# EAGLE schematic console-ifc (EAGLE 7.6.0)

## Sheet 1 of 3
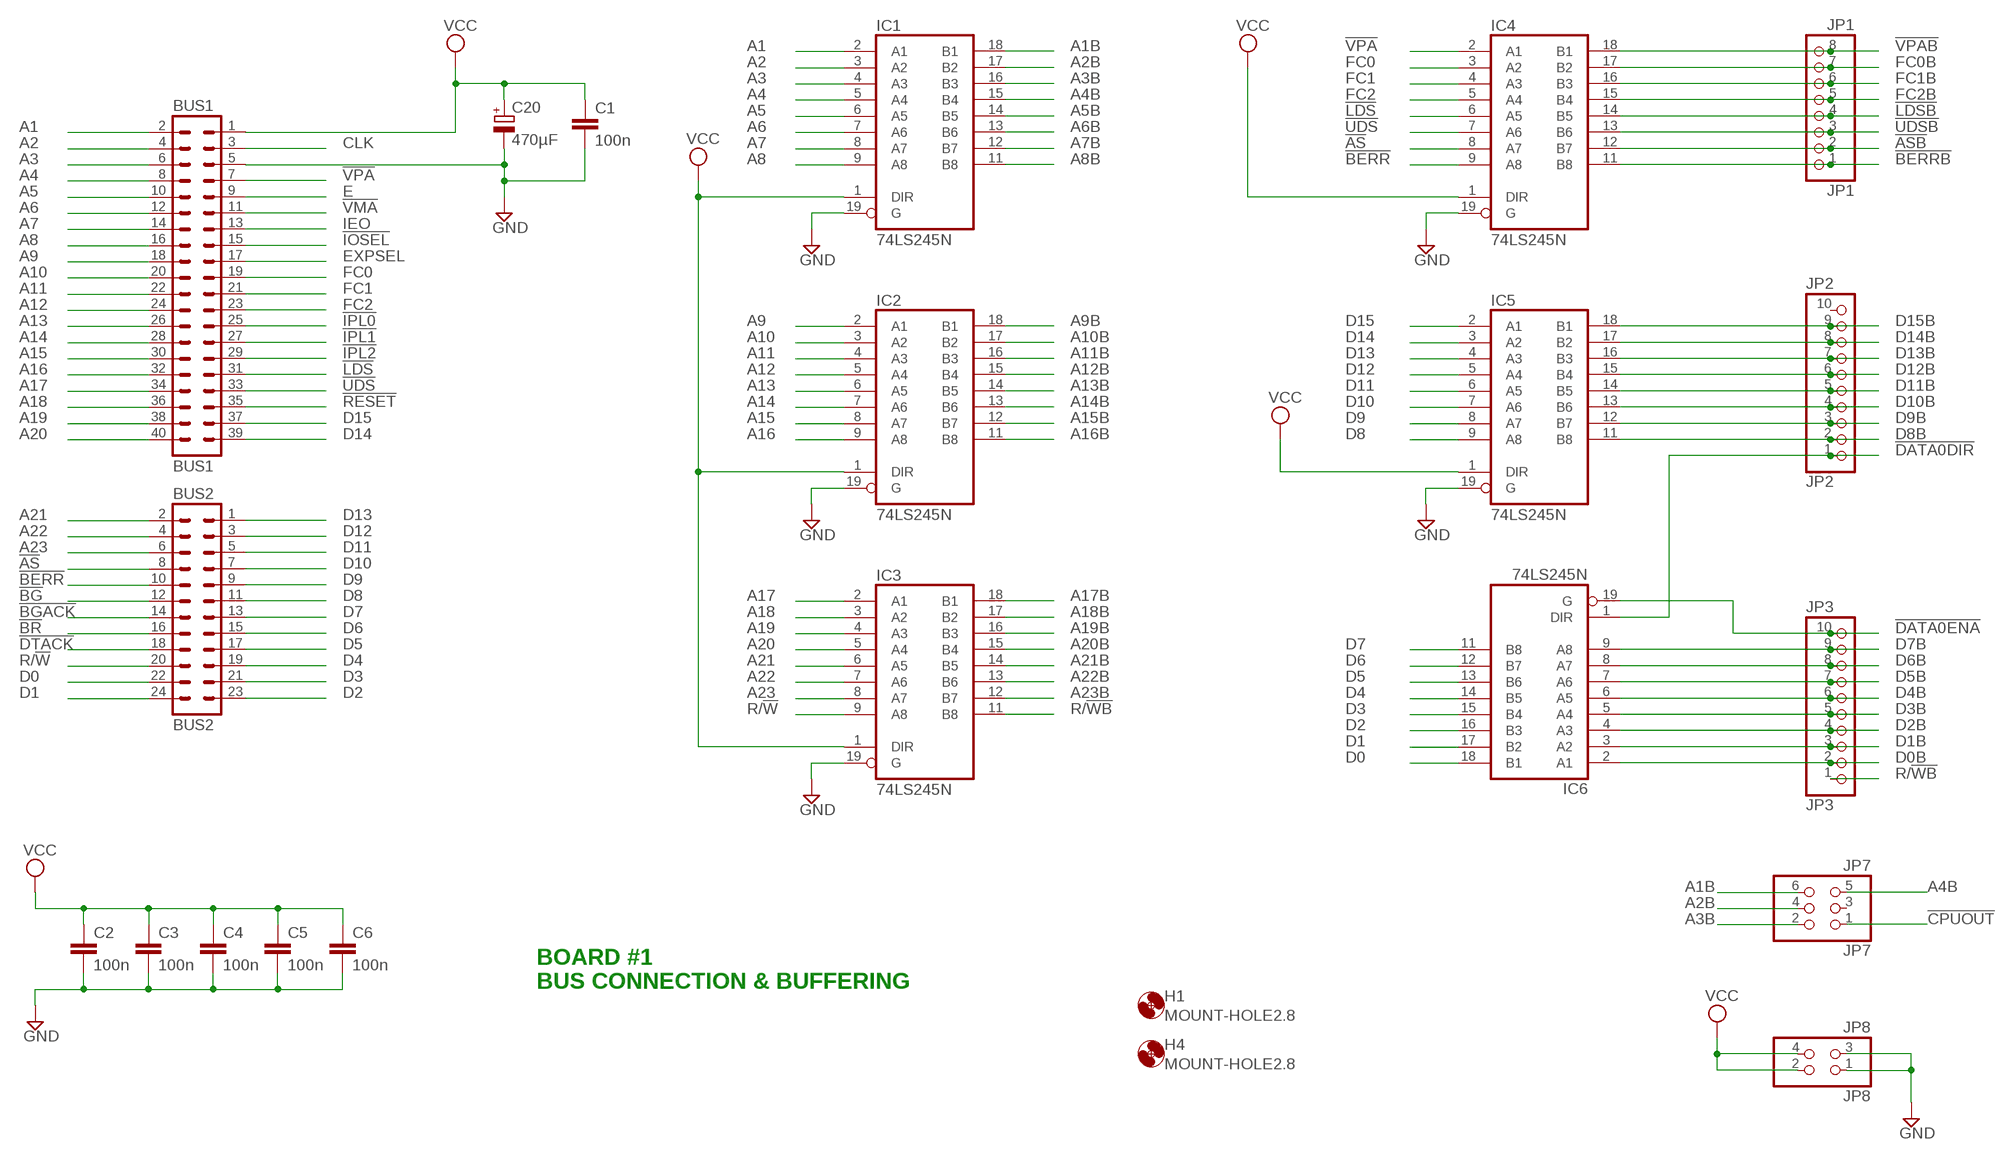
[diagram p0: schematic, sheet 1]

### Parts
BUS1  BUS1  MA20-2  [MA20-2]
BUS2  BUS2  MA12-2  [MA12-2]
C1  100n  C-EU025-024X044  [C025-024X044]
C2  100n  C-EU025-024X044  [C025-024X044]
C3  100n  C-EU025-024X044  [C025-024X044]
C4  100n  C-EU025-024X044  [C025-024X044]
C5  100n  C-EU025-024X044  [C025-024X044]
C6  100n  C-EU025-024X044  [C025-024X044]
C20  470µF  CPOL-EUE2.5-7  [E2,5-7]
H1  MOUNT-HOLE2.8  [2,8]
H4  MOUNT-HOLE2.8  [2,8]
IC1  74LS245N  [DIL20]
IC2  74LS245N  [DIL20]
IC3  74LS245N  [DIL20]
IC4  74LS245N  [DIL20]
IC5  74LS245N  [DIL20]
IC6  74LS245N  [DIL20]
JP1  JP1  PINHD-1X8  [1X08]
JP2  JP2  PINHD-1X10  [1X10]
JP3  JP3  PINHD-1X10  [1X10]
JP7  JP7  PINHD-2X3  [2X03]
JP8  JP8  PINHD-2X2  [2X02]

### Nets
!AS: BUS2.8 IC4.8(A7)
!ASB: IC4.12(B7) JP1.2 ; also sheet 2
!BERR: BUS2.10 IC4.9(A8)
!BERRB: IC4.11(B8) JP1.1
!BG: BUS2.12
!BGACK: BUS2.14
!BR: BUS2.16
!CPUOUT: JP7.1 ; also sheet 2
!DATA0DIR: IC6.1(DIR) JP2.1
!DATA0ENA: IC6.19(G) JP3.10
!DTACK: BUS2.18 ; also sheet 2
!IOSEL: BUS1.15 ; also sheet 2
!IPL0: BUS1.25 ; also sheet 2
!IPL1: BUS1.27 ; also sheet 2
!IPL2: BUS1.29 ; also sheet 2
!LDS: BUS1.31 IC4.6(A5)
!LDSB: IC4.14(B5) JP1.4 ; also sheet 2
!RESET: BUS1.35 ; also sheet 2,3
!UDS: BUS1.33 IC4.7(A6)
!UDSB: IC4.13(B6) JP1.3
!VMA: BUS1.11
!VPA: BUS1.7 IC4.2(A1) ; also sheet 2
!VPAB: IC4.18(B1) JP1.8
A1: BUS1.2 IC1.2(A1)
A1B: IC1.18(B1) JP7.6 ; also sheet 2
A2: BUS1.4 IC1.3(A2)
A2B: IC1.17(B2) JP7.4 ; also sheet 2
A3: BUS1.6 IC1.4(A3)
A3B: IC1.16(B3) JP7.2 ; also sheet 2
A4: BUS1.8 IC1.5(A4)
A4B: IC1.15(B4) JP7.5 ; also sheet 2
A5: BUS1.10 IC1.6(A5)
A5B: IC1.14(B5) ; also sheet 2
A6: BUS1.12 IC1.7(A6)
A6B: IC1.13(B6) ; also sheet 2
A7: BUS1.14 IC1.8(A7)
A7B: IC1.12(B7) ; also sheet 2
A8: BUS1.16 IC1.9(A8)
A8B: IC1.11(B8) ; also sheet 2
A9: BUS1.18 IC2.2(A1)
A9B: IC2.18(B1) ; also sheet 2
A10: BUS1.20 IC2.3(A2)
A10B: IC2.17(B2) ; also sheet 2
A11: BUS1.22 IC2.4(A3)
A11B: IC2.16(B3) ; also sheet 2
A12: BUS1.24 IC2.5(A4)
A12B: IC2.15(B4) ; also sheet 2
A13: BUS1.26 IC2.6(A5)
A13B: IC2.14(B5) ; also sheet 2
A14: BUS1.28 IC2.7(A6)
A14B: IC2.13(B6) ; also sheet 2
A15: BUS1.30 IC2.8(A7)
A15B: IC2.12(B7) ; also sheet 2
A16: BUS1.32 IC2.9(A8)
A16B: IC2.11(B8) ; also sheet 2
A17: BUS1.34 IC3.2(A1)
A17B: IC3.18(B1) ; also sheet 2
A18: BUS1.36 IC3.3(A2)
A18B: IC3.17(B2) ; also sheet 2
A19: BUS1.38 IC3.4(A3)
A19B: IC3.16(B3) ; also sheet 2
A20: BUS1.40 IC3.5(A4)
A20B: IC3.15(B4) ; also sheet 2
A21: BUS2.2 IC3.6(A5)
A21B: IC3.14(B5) ; also sheet 2
A22: BUS2.4 IC3.7(A6)
A22B: IC3.13(B6) ; also sheet 2
A23: BUS2.6 IC3.8(A7)
A23B: IC3.12(B7) ; also sheet 2
CLK: BUS1.3
D0: BUS2.22 IC6.18(B1)
D0B: IC6.2(A1) JP3.2 ; also sheet 3
D1: BUS2.24 IC6.17(B2)
D1B: IC6.3(A2) JP3.3 ; also sheet 3
D2: BUS2.23 IC6.16(B3)
D2B: IC6.4(A3) JP3.4 ; also sheet 3
D3: BUS2.21 IC6.15(B4)
D3B: IC6.5(A4) JP3.5 ; also sheet 3
D4: BUS2.19 IC6.14(B5)
D4B: IC6.6(A5) JP3.6 ; also sheet 3
D5: BUS2.17 IC6.13(B6)
D5B: IC6.7(A6) JP3.7 ; also sheet 3
D6: BUS2.15 IC6.12(B7)
D6B: IC6.8(A7) JP3.8 ; also sheet 3
D7: BUS2.13 IC6.11(B8)
D7B: IC6.9(A8) JP3.9 ; also sheet 3
D8: BUS2.11 IC5.9(A8)
D8B: IC5.11(B8) JP2.2
D9: BUS2.9 IC5.8(A7)
D9B: IC5.12(B7) JP2.3
D10: BUS2.7 IC5.7(A6)
D10B: IC5.13(B6) JP2.4
D11: BUS2.5 IC5.6(A5)
D11B: IC5.14(B5) JP2.5
D12: BUS2.3 IC5.5(A4)
D12B: IC5.15(B4) JP2.6
D13: BUS2.1 IC5.4(A3)
D13B: IC5.16(B3) JP2.7
D14: BUS1.39 IC5.3(A2)
D14B: IC5.17(B2) JP2.8
D15: BUS1.37 IC5.2(A1)
D15B: IC5.18(B1) JP2.9
E: BUS1.9
EXPSEL: BUS1.17
FC0: BUS1.19 IC4.3(A2)
FC0B: IC4.17(B2) JP1.7 ; also sheet 2
FC1: BUS1.21 IC4.4(A3)
FC1B: IC4.16(B3) JP1.6 ; also sheet 2
FC2: BUS1.23 IC4.5(A4)
FC2B: IC4.15(B4) JP1.5 ; also sheet 2
GND [Power]: BUS1.5 C1.2 C2.2 C3.2 C4.2 C5.2 C6.2 C20.- IC1.19(G) IC2.19(G) IC3.19(G) IC4.19(G) IC5.19(G) JP8.1 JP8.3 ; also sheet 2,3
IEO: BUS1.13
R/!W: BUS2.20 IC3.9(A8)
R/!WB: IC3.11(B8) JP3.1
VCC [Power]: BUS1.1 C1.1 C2.1 C3.1 C4.1 C5.1 C6.1 C20.+ IC1.1(DIR) IC2.1(DIR) IC3.1(DIR) IC4.1(DIR) IC5.1(DIR) JP8.2 JP8.4 ; also sheet 2,3
Unconnected: JP2.10 JP7.3

### Notes on the sheet
- BOARD #1
  BUS CONNECTION & BUFFERING

## Sheet 2 of 3
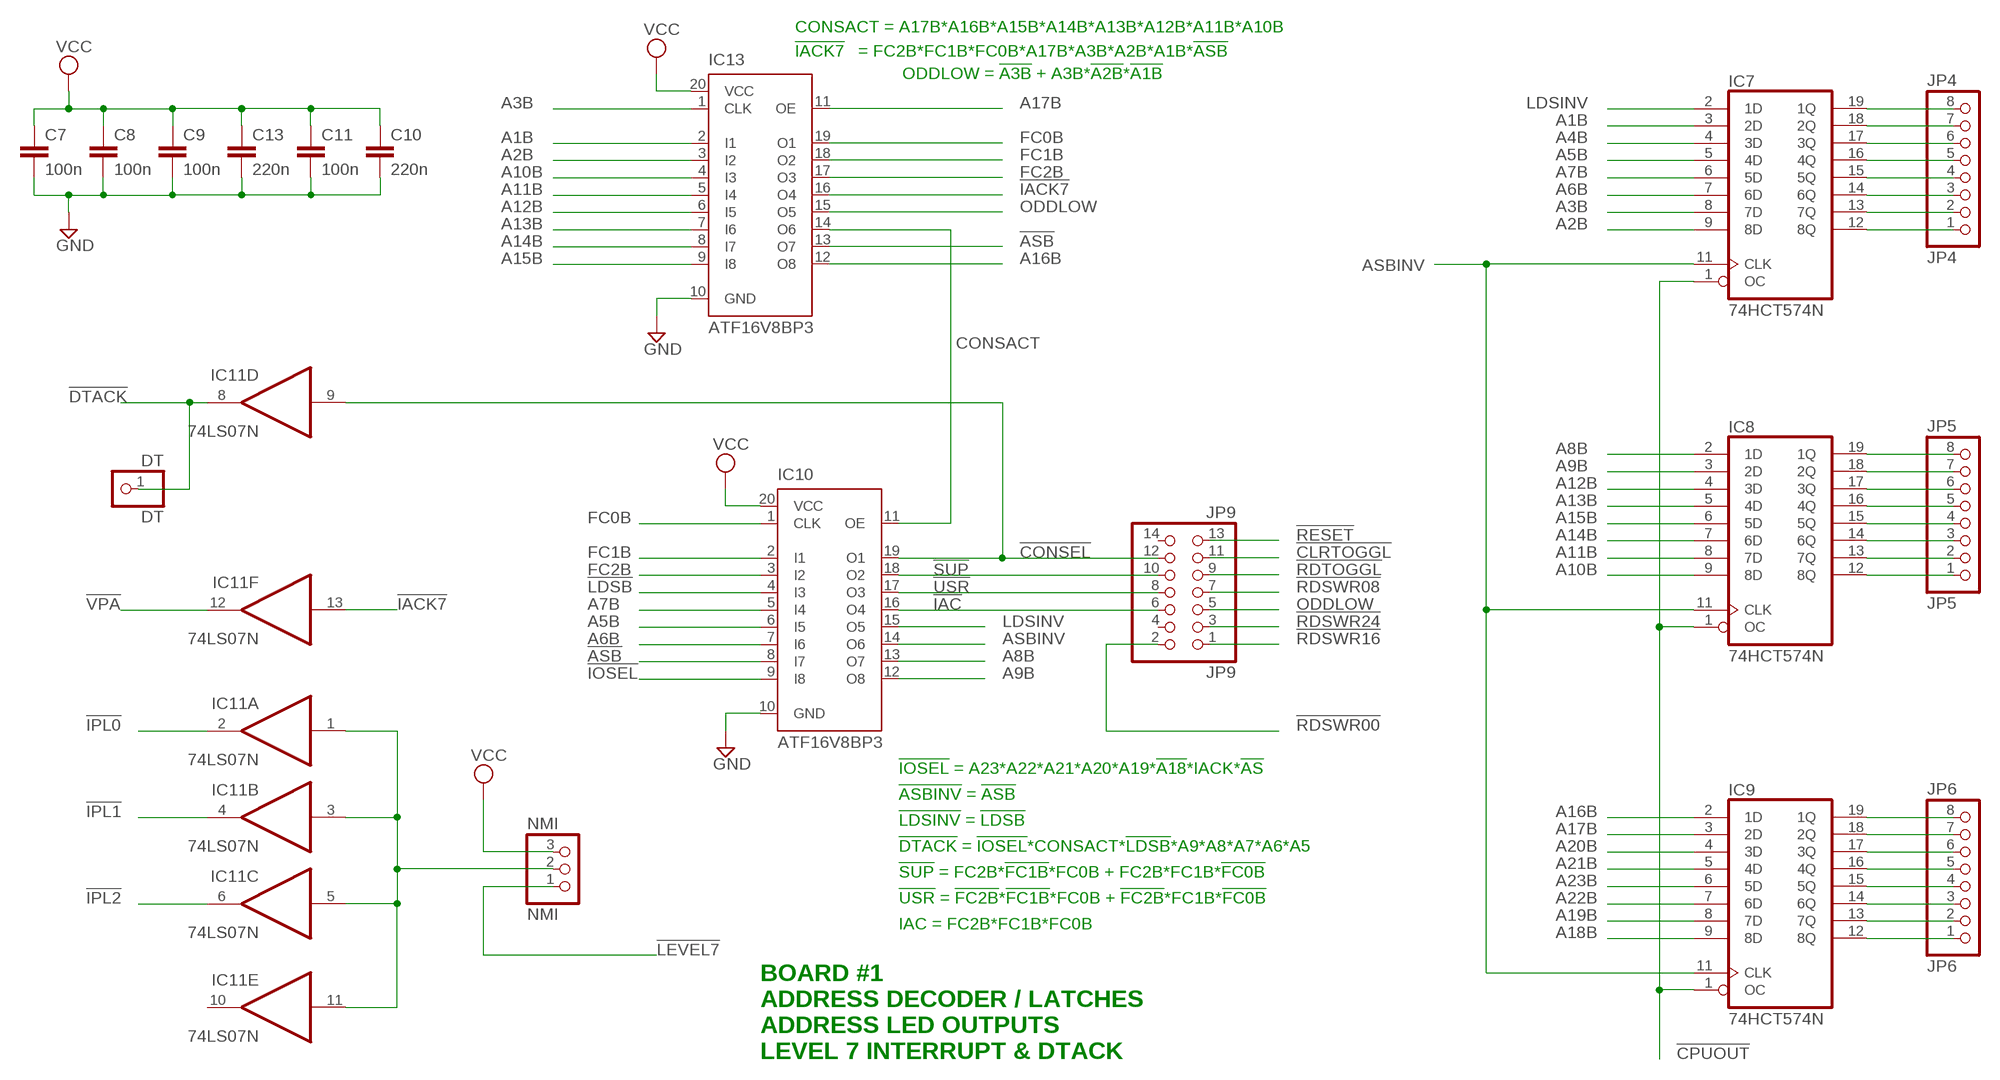
[diagram p1: schematic, sheet 2]

### Parts
C7  100n  C-EU025-024X044  [C025-024X044]
C8  100n  C-EU025-024X044  [C025-024X044]
C9  100n  C-EU025-024X044  [C025-024X044]
C10  220n  C-EU025-024X044  [C025-024X044]
C11  100n  C-EU025-024X044  [C025-024X044]
C13  220n  C-EU025-024X044  [C025-024X044]
DT  DT  PINHD-1X1  [1X01]
IC7  74HCT574N  [DIL20]
IC8  74HCT574N  [DIL20]
IC9  74HCT574N  [DIL20]
IC10  ATF16V8BP3  [DIL20]
IC11  74LS07N  [DIL14]
IC13  ATF16V8BP3  [DIL20]
JP4  JP4  PINHD-1X8  [1X08]
JP5  JP5  PINHD-1X8  [1X08]
JP6  JP6  PINHD-1X8  [1X08]
JP9  JP9  PINHD-2X7  [2X07]
NMI  NMI  PINHD-1X3  [1X03]

### Nets
!ASB: IC10.8(I7) IC13.13(O7) ; also sheet 1
!CLRTOGGL: JP9.11 ; also sheet 3
!CONSEL: IC10.19(O1) IC11.9(D:I) JP9.12
!CPUOUT: IC7.1(OC) IC8.1(OC) IC9.1(OC) ; also sheet 1
!DTACK: DT.1 IC11.8(D:O) ; also sheet 1
!IAC: IC10.16(O4) JP9.6
!IACK7: IC11.13(F:I) IC13.16(O4) ; also sheet 3
!IOSEL: IC10.9(I8) ; also sheet 1
!IPL0: IC11.2(A:O) ; also sheet 1
!IPL1: IC11.4(B:O) ; also sheet 1
!IPL2: IC11.6(C:O) ; also sheet 1
!LDSB: IC10.4(I3) ; also sheet 1
!LEVEL7: NMI.1 ; also sheet 3
!RDSWR00: JP9.2 ; also sheet 3
!RDSWR08: JP9.7 ; also sheet 3
!RDSWR16: JP9.1 ; also sheet 3
!RDSWR24: JP9.3 ; also sheet 3
!RDTOGGL: JP9.9 ; also sheet 3
!RESET: JP9.13 ; also sheet 1,3
!SUP: IC10.18(O2) JP9.10
!USR: IC10.17(O3) JP9.8
!VPA: IC11.12(F:O) ; also sheet 1
A1B: IC7.3(2D) IC13.2(I1) ; also sheet 1
A2B: IC7.9(8D) IC13.3(I2) ; also sheet 1
A3B: IC7.8(7D) IC13.1(CLK) ; also sheet 1
A4B: IC7.4(3D) ; also sheet 1
A5B: IC7.5(4D) IC10.6(I5) ; also sheet 1
A6B: IC7.7(6D) IC10.7(I6) ; also sheet 1
A7B: IC7.6(5D) IC10.5(I4) ; also sheet 1
A8B: IC8.2(1D) IC10.13(O7) ; also sheet 1
A9B: IC8.3(2D) IC10.12(O8) ; also sheet 1
A10B: IC8.9(8D) IC13.4(I3) ; also sheet 1
A11B: IC8.8(7D) IC13.5(I4) ; also sheet 1
A12B: IC8.4(3D) IC13.6(I5) ; also sheet 1
A13B: IC8.5(4D) IC13.7(I6) ; also sheet 1
A14B: IC8.7(6D) IC13.8(I7) ; also sheet 1
A15B: IC8.6(5D) IC13.9(I8) ; also sheet 1
A16B: IC9.2(1D) IC13.12(O8) ; also sheet 1
A17B: IC9.3(2D) IC13.11(OE) ; also sheet 1
A18B: IC9.9(8D) ; also sheet 1
A19B: IC9.8(7D) ; also sheet 1
A20B: IC9.4(3D) ; also sheet 1
A21B: IC9.5(4D) ; also sheet 1
A22B: IC9.7(6D) ; also sheet 1
A23B: IC9.6(5D) ; also sheet 1
ASBINV: IC7.11(CLK) IC8.11(CLK) IC9.11(CLK) IC10.14(O6)
CONSACT: IC10.11(OE) IC13.14(O6)
FC0B: IC10.1(CLK) IC13.19(O1) ; also sheet 1
FC1B: IC10.2(I1) IC13.18(O2) ; also sheet 1
FC2B: IC10.3(I2) IC13.17(O3) ; also sheet 1
GND [Power]: C7.2 C8.2 C9.2 C10.2 C11.2 C13.2 IC10.10(GND) IC13.10(GND) ; also sheet 1,3
LDSINV: IC7.2(1D) IC10.15(O5)
N$1: IC7.19(1Q) JP4.8
N$2: IC11.1(A:I) IC11.3(B:I) IC11.5(C:I) IC11.11(E:I) NMI.2
N$3: IC8.19(1Q) JP5.8
N$4: IC7.18(2Q) JP4.7
N$7: IC7.17(3Q) JP4.6
N$14: IC7.16(4Q) JP4.5
N$15: IC7.15(5Q) JP4.4
N$16: IC7.14(6Q) JP4.3
N$17: IC7.13(7Q) JP4.2
N$21: IC7.12(8Q) JP4.1
N$22: IC8.18(2Q) JP5.7
N$23: IC8.17(3Q) JP5.6
N$24: IC8.16(4Q) JP5.5
N$25: IC8.15(5Q) JP5.4
N$26: IC8.14(6Q) JP5.3
N$27: IC8.13(7Q) JP5.2
N$28: IC8.12(8Q) JP5.1
N$29: IC9.19(1Q) JP6.8
N$30: IC9.18(2Q) JP6.7
N$31: IC9.17(3Q) JP6.6
N$32: IC9.16(4Q) JP6.5
N$33: IC9.15(5Q) JP6.4
N$34: IC9.14(6Q) JP6.3
N$35: IC9.13(7Q) JP6.2
N$36: IC9.12(8Q) JP6.1
ODDLOW: IC13.15(O5) JP9.5
VCC [Power]: C7.1 C8.1 C9.1 C10.1 C11.1 C13.1 IC10.20(VCC) IC13.20(VCC) NMI.3 ; also sheet 1,3
Unconnected: IC11.10(E:O) JP9.4 JP9.14

### Notes on the sheet
- CONSACT = A17B*A16B*A15B*A14B*A13B*A12B*A11B*A10B
- !IACK7!   = FC2B*FC1B*FC0B*A17B*A3B*A2B*A1B*!ASB
- ODDLOW = !A3B! + A3B*!A2B!*!A1B!
- !IOSEL! = A23*A22*A21*A20*A19*!A18!*IACK*!AS
- !ASBINV! = !ASB
- !LDSINV! = !LDSB
- !DTACK! = !IOSEL!*CONSACT*!LDSB!*A9*A8*A7*A6*A5
- !SUP! = FC2B*!FC1B!*FC0B + FC2B*FC1B*!FC0B
- !USR! = !FC2B!*!FC1B!*FC0B + !FC2B!*FC1B*!FC0B
- IAC = FC2B*FC1B*FC0B
- BOARD #1
  ADDRESS DECODER / LATCHES
  ADDRESS LED OUTPUTS
  LEVEL 7 INTERRUPT & DTACK

## Sheet 3 of 3
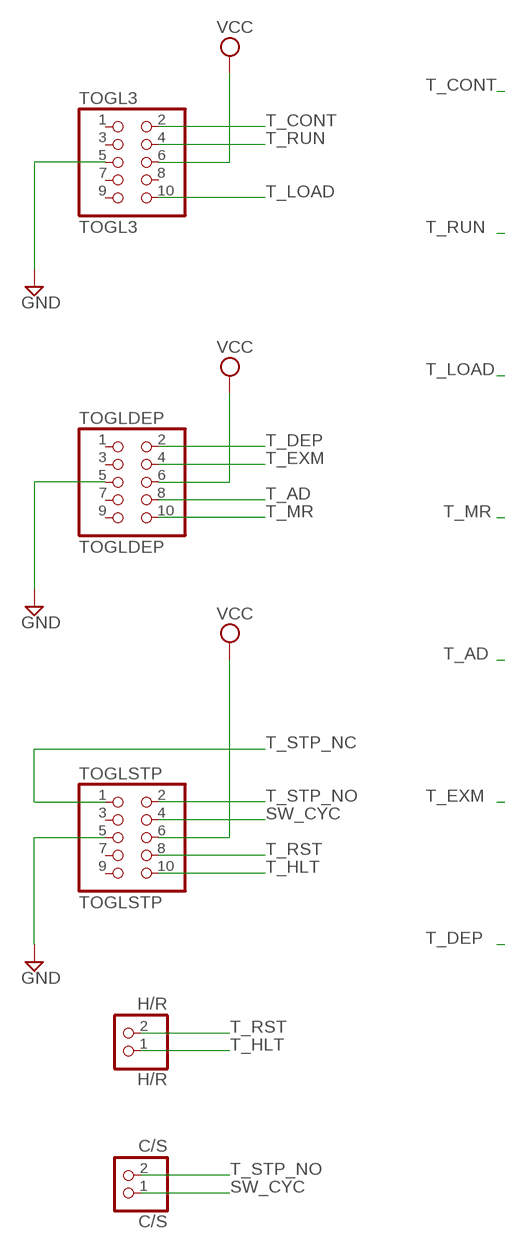
[diagram p2: schematic, sheet 3, part 1 of 2]
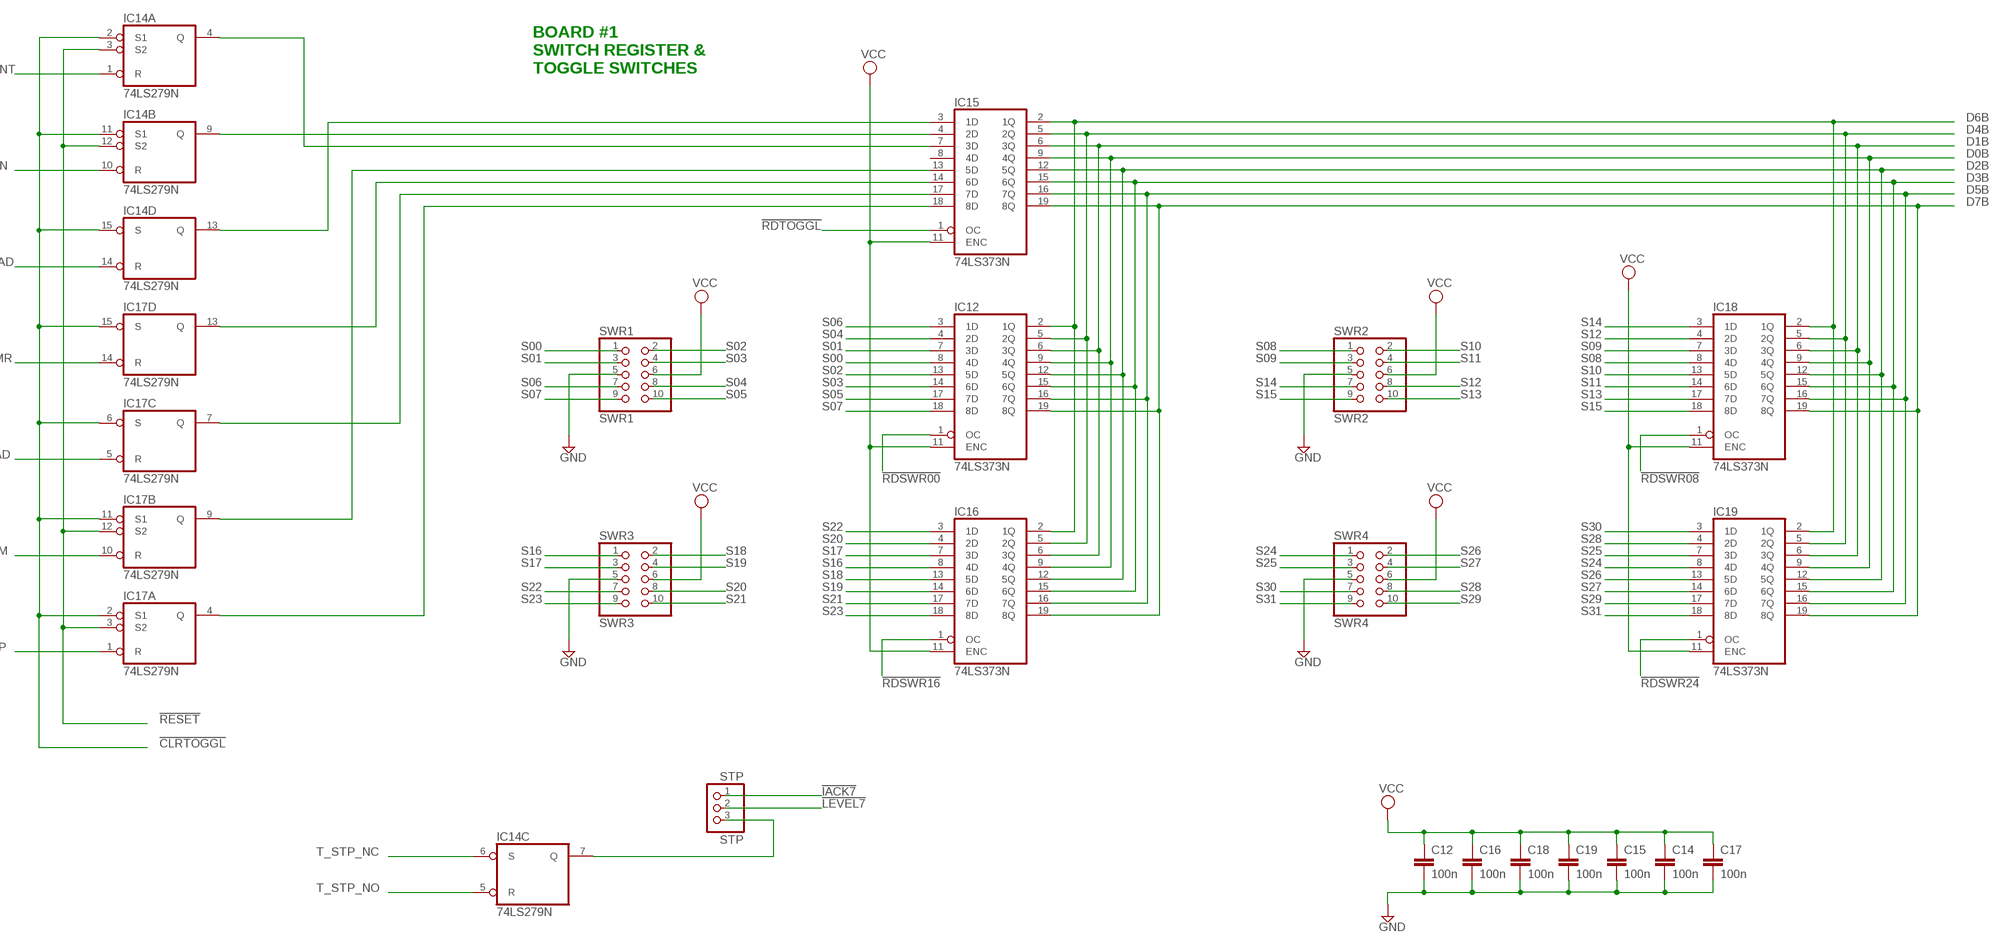
[diagram p3: schematic, sheet 3, part 2 of 2]

### Parts
C12  100n  C-EU025-024X044  [C025-024X044]
C14  100n  C-EU025-024X044  [C025-024X044]
C15  100n  C-EU025-024X044  [C025-024X044]
C16  100n  C-EU025-024X044  [C025-024X044]
C17  100n  C-EU025-024X044  [C025-024X044]
C18  100n  C-EU025-024X044  [C025-024X044]
C19  100n  C-EU025-024X044  [C025-024X044]
C/S  C/S  PINHD-1X2  [1X02]
H/R  H/R  PINHD-1X2  [1X02]
IC12  74LS373N  [DIL20]
IC14  74LS279N  [DIL16]
IC15  74LS373N  [DIL20]
IC16  74LS373N  [DIL20]
IC17  74LS279N  [DIL16]
IC18  74LS373N  [DIL20]
IC19  74LS373N  [DIL20]
STP  STP  PINHD-1X3  [1X03]
SWR1  SWR1  PINHD-2X5  [2X05]
SWR2  SWR2  PINHD-2X5  [2X05]
SWR3  SWR3  PINHD-2X5  [2X05]
SWR4  SWR4  PINHD-2X5  [2X05]
TOGL3  TOGL3  PINHD-2X5  [2X05]
TOGLDEP  TOGLDEP  PINHD-2X5  [2X05]
TOGLSTP  TOGLSTP  PINHD-2X5  [2X05]

### Nets
!CLRTOGGL: IC14.2(A:S1) IC14.11(B:S1) IC14.15(D:S) IC17.2(A:S1) IC17.6(C:S) IC17.11(B:S1) IC17.15(D:S) ; also sheet 2
!IACK7: STP.1 ; also sheet 2
!LEVEL7: STP.2 ; also sheet 2
!RDSWR00: IC12.1(OC) ; also sheet 2
!RDSWR08: IC18.1(OC) ; also sheet 2
!RDSWR16: IC16.1(OC) ; also sheet 2
!RDSWR24: IC19.1(OC) ; also sheet 2
!RDTOGGL: IC15.1(OC) ; also sheet 2
!RESET: IC14.3(A:S2) IC14.12(B:S2) IC17.3(A:S2) IC17.12(B:S2) ; also sheet 1,2
D0B: IC12.9(4Q) IC15.9(4Q) IC16.9(4Q) IC18.9(4Q) IC19.9(4Q) ; also sheet 1
D1B: IC12.6(3Q) IC15.6(3Q) IC16.6(3Q) IC18.6(3Q) IC19.6(3Q) ; also sheet 1
D2B: IC12.12(5Q) IC15.12(5Q) IC16.12(5Q) IC18.12(5Q) IC19.12(5Q) ; also sheet 1
D3B: IC12.15(6Q) IC15.15(6Q) IC16.15(6Q) IC18.15(6Q) IC19.15(6Q) ; also sheet 1
D4B: IC12.5(2Q) IC15.5(2Q) IC16.5(2Q) IC18.5(2Q) IC19.5(2Q) ; also sheet 1
D5B: IC12.16(7Q) IC15.16(7Q) IC16.16(7Q) IC18.16(7Q) IC19.16(7Q) ; also sheet 1
D6B: IC12.2(1Q) IC15.2(1Q) IC16.2(1Q) IC18.2(1Q) IC19.2(1Q) ; also sheet 1
D7B: IC12.19(8Q) IC15.19(8Q) IC16.19(8Q) IC18.19(8Q) IC19.19(8Q) ; also sheet 1
GND [Power]: C12.2 C14.2 C15.2 C16.2 C17.2 C18.2 C19.2 SWR1.5 SWR2.5 SWR3.5 SWR4.5 TOGL3.5 TOGLDEP.5 TOGLSTP.5 ; also sheet 1,2
N$5: IC15.18(8D) IC17.4(A:Q)
N$6: IC14.7(C:Q) STP.3
N$8: IC15.17(7D) IC17.7(C:Q)
N$9: IC15.14(6D) IC17.13(D:Q)
N$10: IC15.13(5D) IC17.9(B:Q)
N$11: IC14.13(D:Q) IC15.3(1D)
N$12: IC14.9(B:Q) IC15.4(2D)
N$13: IC14.4(A:Q) IC15.7(3D)
S00: IC12.8(4D) SWR1.1
S01: IC12.7(3D) SWR1.3
S02: IC12.13(5D) SWR1.2
S03: IC12.14(6D) SWR1.4
S04: IC12.4(2D) SWR1.8
S05: IC12.17(7D) SWR1.10
S06: IC12.3(1D) SWR1.7
S07: IC12.18(8D) SWR1.9
S08: IC18.8(4D) SWR2.1
S09: IC18.7(3D) SWR2.3
S10: IC18.13(5D) SWR2.2
S11: IC18.14(6D) SWR2.4
S12: IC18.4(2D) SWR2.8
S13: IC18.17(7D) SWR2.10
S14: IC18.3(1D) SWR2.7
S15: IC18.18(8D) SWR2.9
S16: IC16.8(4D) SWR3.1
S17: IC16.7(3D) SWR3.3
S18: IC16.13(5D) SWR3.2
S19: IC16.14(6D) SWR3.4
S20: IC16.4(2D) SWR3.8
S21: IC16.17(7D) SWR3.10
S22: IC16.3(1D) SWR3.7
S23: IC16.18(8D) SWR3.9
S24: IC19.8(4D) SWR4.1
S25: IC19.7(3D) SWR4.3
S26: IC19.13(5D) SWR4.2
S27: IC19.14(6D) SWR4.4
S28: IC19.4(2D) SWR4.8
S29: IC19.17(7D) SWR4.10
S30: IC19.3(1D) SWR4.7
S31: IC19.18(8D) SWR4.9
SW_CYC: C/S.1 TOGLSTP.4
T_AD: IC17.5(C:R) TOGLDEP.8
T_CONT: IC14.1(A:R) TOGL3.2
T_DEP: IC17.1(A:R) TOGLDEP.2
T_EXM: IC17.10(B:R) TOGLDEP.4
T_HLT: H/R.1 TOGLSTP.10
T_LOAD: IC14.14(D:R) TOGL3.10
T_MR: IC17.14(D:R) TOGLDEP.10
T_RST: H/R.2 TOGLSTP.8
T_RUN: IC14.10(B:R) TOGL3.4
T_STP_NC: IC14.6(C:S) TOGLSTP.1
T_STP_NO: C/S.2 IC14.5(C:R) TOGLSTP.2
VCC [Power]: C12.1 C14.1 C15.1 C16.1 C17.1 C18.1 C19.1 IC12.11(ENC) IC15.11(ENC) IC16.11(ENC) IC18.11(ENC) IC19.11(ENC) SWR1.6 SWR2.6 SWR3.6 SWR4.6 TOGL3.6 TOGLDEP.6 TOGLSTP.6 ; also sheet 1,2
Unconnected: IC15.8(4D) TOGL3.1 TOGL3.3 TOGL3.7 TOGL3.8 TOGL3.9 TOGLDEP.1 TOGLDEP.3 TOGLDEP.7 TOGLDEP.9 TOGLSTP.3 TOGLSTP.7 TOGLSTP.9

### Notes on the sheet
- BOARD #1
  SWITCH REGISTER &
  TOGGLE SWITCHES

## Power pins joined to a net without a drawn wire
GND: IC1.10(GND) IC2.10(GND) IC3.10(GND) IC4.10(GND) IC5.10(GND) IC6.10(GND) IC7.10(GND) IC8.10(GND) IC9.10(GND) IC11.7(P:GND) IC12.10(GND) IC14.8(P:GND) IC15.10(GND) IC16.10(GND) IC17.8(P:GND) IC18.10(GND) IC19.10(GND)
VCC: IC1.20(VCC) IC2.20(VCC) IC3.20(VCC) IC4.20(VCC) IC5.20(VCC) IC6.20(VCC) IC7.20(VCC) IC8.20(VCC) IC9.20(VCC) IC11.14(P:VCC) IC12.20(VCC) IC14.16(P:VCC) IC15.20(VCC) IC16.20(VCC) IC17.16(P:VCC) IC18.20(VCC) IC19.20(VCC)

## Library data of the parts
BUS1 = con-lstb:MA20-2: PIN HEADER; OC_FARNELL: unknown; OC_NEWARK: unknown
BUS2 = con-lstb:MA12-2: PIN HEADER; OC_FARNELL: unknown; OC_NEWARK: unknown
C1-C19 = rcl:C-EU: CAPACITOR, European symbol
C20 = rcl:CPOL-EU: POLARIZED CAPACITOR, European symbol
C/S H/R = pinhead:PINHD-1X2: PIN HEADER
DT = pinhead:PINHD-1X1: PIN HEADER
H1 H4 = holes:MOUNT-HOLE: MOUNTING HOLE with drill center marker
IC1-IC6 = 74xx-eu:74*245: Octal BUS TRANSCEIVER, 3-state
IC7-IC9 = 74xx-eu:74*574: 8-bit D type FLIP FLOP bus driver
IC10 IC13 = atmel:ATF16V8B: High perfomance CMOS (electrically erasable) programmable logic device (PLD) ABLE-Atmel-ABEL - P18V8R, P16V8C, P16V8AS, P17V8 COPL Atmel-WinCUPL - G16V8MS, G16V8MA, G16V8AS, G16V8 LOG/IC - GAL16V8_R, GAL16V8_G7, GAL16V8_C), GAL16V8 Tango-PLD - G16V8R, G16V8C, G16V8AS, G16V8 Source: http://www.atmel.com/dyn/resources/prod_documents/DOC0364.PDF; MPN: ATF16V8CZ-15PU; OC_FARNELL: 1551768; OC_NEWARK: 94M6254
IC11 = 74xx-eu:74*07: Hex BUFFER, open collector high-voltage output
IC12 IC15 IC16 IC18 IC19 = 74xx-eu:74*373: Octal D type transparent LATCH, edge triggered
IC14 IC17 = 74xx-eu:74*279: Quadruple S-R LATCH
JP1 JP4-JP6 = pinhead:PINHD-1X8: PIN HEADER
JP2 JP3 = pinhead:PINHD-1X10: PIN HEADER
JP7 = pinhead:PINHD-2X3: PIN HEADER
JP8 = pinhead:PINHD-2X2: PIN HEADER
JP9 = pinhead:PINHD-2X7: PIN HEADER
NMI STP = pinhead:PINHD-1X3: PIN HEADER
SWR1-SWR4 TOGL3 TOGLDEP TOGLSTP = pinhead:PINHD-2X5: PIN HEADER

## Net classes
0 default: width 0.203 mm, drill 0.203 mm, clearance 0.203 mm
1 Power: width 0.406 mm, drill 0.254 mm, clearance 0.254 mm